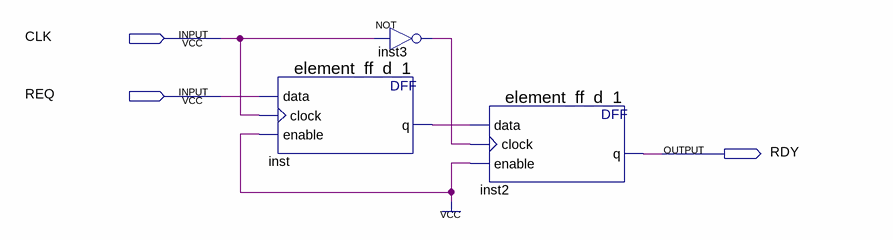
[diagram p0: schematic sheet]
// Quartus schematic block-writer-variant-pass.bdf as structural Verilog: 3 symbols, 3 pins
module \block-writer-variant-pass  (
  input  CLK,
  input  REQ,
  output RDY
);

  wire inst3_out, inst_q;

  element_ff_d_1 inst (.data(REQ), .clock(CLK), .enable(1'b1), .q(inst_q));
  not inst3 (inst3_out, CLK);
  element_ff_d_1 inst2 (.data(inst_q), .clock(inst3_out), .enable(1'b1), .q(RDY));
endmodule
